# Altium schematic sheet MB786.SchDoc
size A3; Revision: C.2(PCB.SCH)
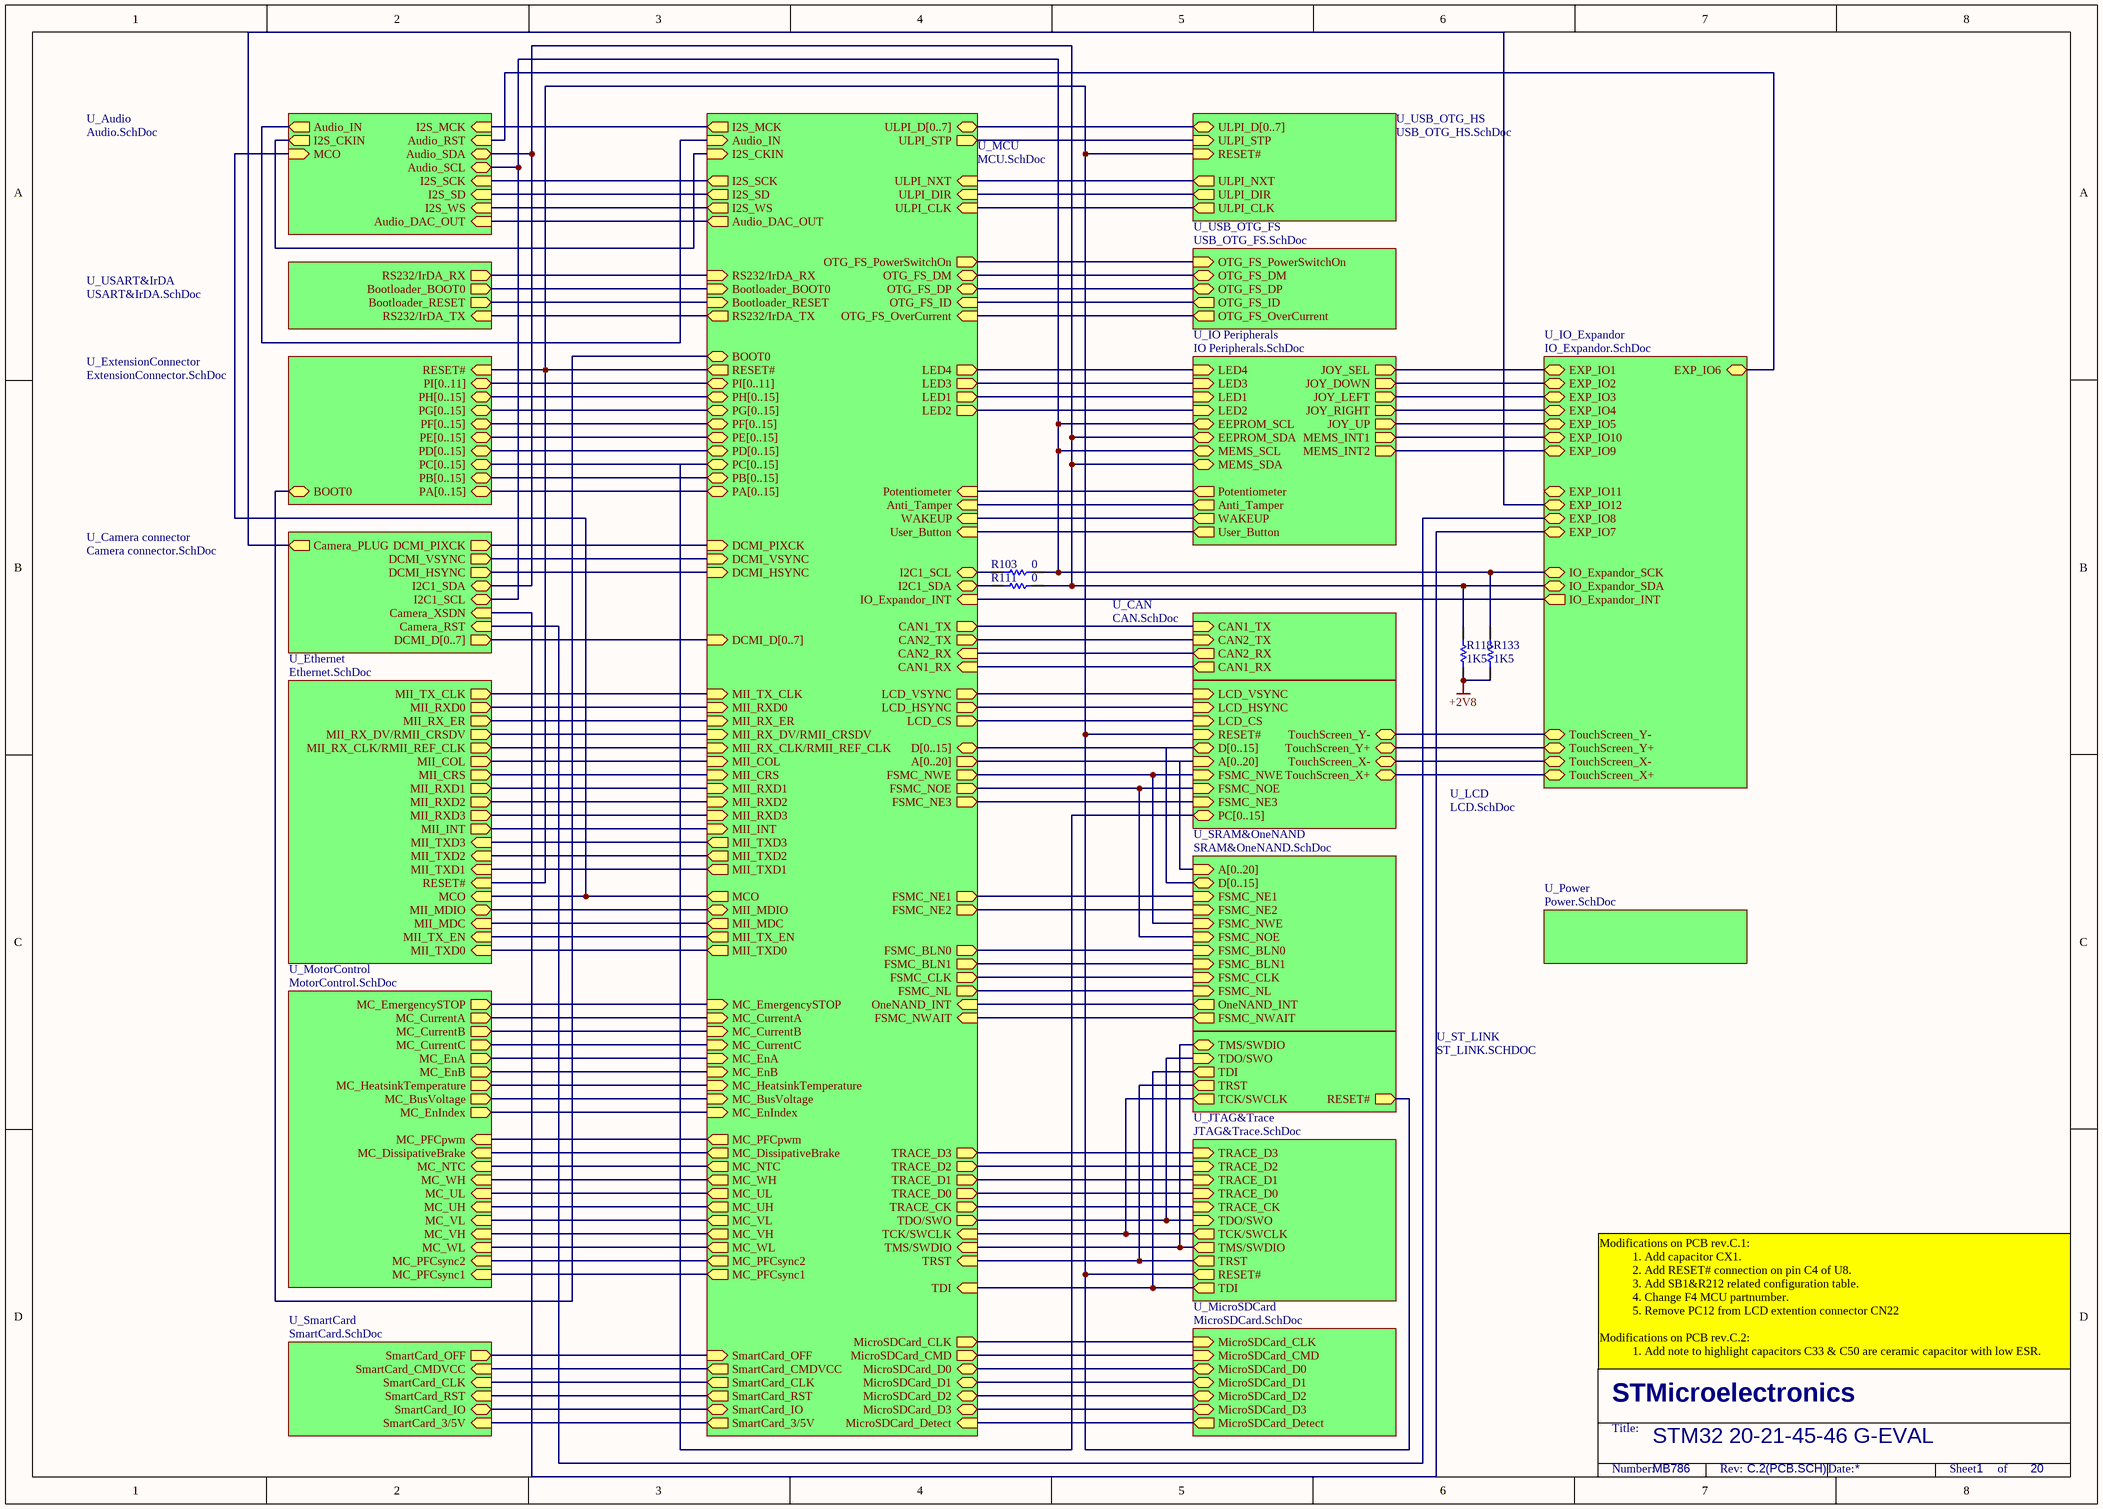
[diagram p0: MB786.SchDoc]

## Parts
R103  0  [0603R]
R111  0  [0603R]
R118  1K5  [0603R]
R133  1K5  [0603R]

## Sub-sheets
U_Audio = Audio.SchDoc: I2S_WS (in), I2S_SD (in), I2S_SCK (in), Audio_SCL (bidir), Audio_SDA (bidir), Audio_RST (in), I2S_MCK (in), Audio_DAC_OUT (in), Audio_IN (out), I2S_CKIN (out), MCO (in)
U_Camera connector = Camera connector.SchDoc: DCMI_PIXCK (out), DCMI_VSYNC (out), DCMI_D[0..7] (out), DCMI_HSYNC (out), Camera_RST (in), I2C1_SCL (bidir), I2C1_SDA (bidir), Camera_XSDN (in), Camera_PLUG (out)
U_CAN = CAN.SchDoc: CAN1_TX (in), CAN1_RX (out), CAN2_TX (in), CAN2_RX (out)
U_Ethernet = Ethernet.SchDoc: MII_TXD0 (in), MII_TX_EN (in), MII_TX_CLK (out), MII_RXD0 (out), MII_RX_ER (out), MII_RX_DV/RMII_CRSDV (out), MII_RX_CLK/RMII_REF_CLK (out), MII_COL (out), MII_CRS (out), MII_MDC (in), MII_MDIO (bidir), MCO (in), RESET# (in), MII_TXD1 (in), MII_TXD2 (in), MII_TXD3 (in), MII_RXD1 (out), MII_RXD2 (out), MII_RXD3 (out), MII_INT (out)
U_ExtensionConnector = ExtensionConnector.SchDoc: RESET# (in), PA[0..15] (bidir), PB[0..15] (bidir), PC[0..15] (bidir), PD[0..15] (bidir), PE[0..15] (bidir), PF[0..15] (bidir), PG[0..15] (bidir), PH[0..15] (bidir), PI[0..11] (bidir), BOOT0 (bidir)
U_IO Peripherals = IO Peripherals.SchDoc: LED4 (in), LED3 (in), LED1 (in), LED2 (in), Potentiometer (out), JOY_SEL (out), JOY_DOWN (out), JOY_LEFT (out), JOY_RIGHT (out), JOY_UP (out), Anti_Tamper (out), WAKEUP (out), User_Button (out), EEPROM_SCL (bidir), EEPROM_SDA (bidir), MEMS_SCL (bidir), MEMS_SDA (bidir), MEMS_INT1 (out), MEMS_INT2 (out)
U_IO_Expandor = IO_Expandor.SchDoc: IO_Expandor_SCK (bidir), IO_Expandor_SDA (bidir), IO_Expandor_INT (out), TouchScreen_X+ (bidir), TouchScreen_X- (bidir), TouchScreen_Y+ (bidir), TouchScreen_Y- (bidir), EXP_IO2 (bidir), EXP_IO3 (bidir), EXP_IO4 (bidir), EXP_IO5 (bidir), EXP_IO6 (bidir), EXP_IO7 (bidir), EXP_IO8 (bidir), EXP_IO9 (bidir), EXP_IO10 (bidir), EXP_IO11 (bidir), EXP_IO12 (bidir), EXP_IO1 (bidir)
U_JTAG&Trace = JTAG&Trace.SchDoc: TDI (out), RESET# (out), TRACE_D3 (in), TRACE_D2 (in), TRACE_D1 (in), TRACE_D0 (in), TRACE_CK (in), TRST (out), TMS/SWDIO (out), TCK/SWCLK (out), TDO/SWO (in)
U_LCD = LCD.SchDoc: TouchScreen_X+ (bidir), TouchScreen_X- (bidir), TouchScreen_Y+ (bidir), TouchScreen_Y- (bidir), RESET# (in), D[0..15] (bidir), A[0..20] (in), FSMC_NWE (in), FSMC_NOE (in), FSMC_NE3 (in), LCD_VSYNC (in), LCD_HSYNC (in), LCD_CS (in), PC[0..15] (bidir)
U_MCU = MCU.SchDoc: PA[0..15] (bidir), PB[0..15] (bidir), PC[0..15] (bidir), PD[0..15] (bidir), PE[0..15] (bidir), RESET# (out), Bootloader_BOOT0 (in), Bootloader_RESET (in), DCMI_PIXCK (in), DCMI_VSYNC (in), DCMI_D[0..7] (in), DCMI_HSYNC (in), MCO (out), ULPI_D[0..7] (bidir), ULPI_CLK (in), ULPI_DIR (in), ULPI_NXT (in), ULPI_STP (out), RS232/IrDA_TX (out), RS232/IrDA_RX (in), OTG_FS_PowerSwitchOn (out), OTG_FS_OverCurrent (in), OTG_FS_DM (bidir), OTG_FS_DP (bidir), OTG_FS_ID (in), I2S_WS (out), I2S_SD (out), I2S_SCK (out), I2S_MCK (out), Audio_DAC_OUT (out), CAN1_TX (out), CAN1_RX (in), CAN2_TX (out), CAN2_RX (in), MII_TXD0 (out), MII_TX_EN (out), MII_TX_CLK (in), MII_RXD0 (in), MII_RX_ER (in), MII_RX_DV/RMII_CRSDV (in), MII_RX_CLK/RMII_REF_CLK (in), MII_COL (in), MII_CRS (in), MII_MDC (out), MII_MDIO (bidir), MII_TXD1 (out), MII_TXD2 (out), MII_TXD3 (out), MII_RXD1 (in), MII_RXD2 (in), MII_RXD3 (in), MII_INT (in), LED4 (out), LED3 (out), LED1 (out), LED2 (out), Potentiometer (in), Anti_Tamper (in), WAKEUP (in), User_Button (in), I2C1_SCL (bidir), I2C1_SDA (bidir), IO_Expandor_INT (in), TDI (in), TRACE_D3 (out), TRACE_D2 (out), TRACE_D1 (out), TRACE_D0 (out), TRACE_CK (out), TRST (in), TMS/SWDIO (in), TCK/SWCLK (in), TDO/SWO (out), D[0..15] (bidir), A[0..20] (out), FSMC_NE3 (out), MicroSDCard_CLK (out), MicroSDCard_CMD (out), MicroSDCard_D0 (bidir), MicroSDCard_D1 (bidir), MicroSDCard_D2 (bidir), MicroSDCard_D3 (bidir), MicroSDCard_Detect (in), MC_EmergencySTOP (in), MC_CurrentA (in), MC_CurrentB (in), MC_CurrentC (in), MC_PFCsync1 (out), MC_PFCsync2 (out), MC_WL (out), MC_VH (out), MC_VL (out), MC_UH (out), MC_UL (out), MC_WH (out), MC_NTC (out), MC_DissipativeBrake (out), MC_PFCpwm (out), MC_EnA (in), MC_EnB (in), MC_HeatsinkTemperature (in), MC_BusVoltage (in), MC_EnIndex (in), SmartCard_3/5V (out), SmartCard_IO (bidir), SmartCard_RST (out), SmartCard_CLK (out), SmartCard_OFF (in), SmartCard_CMDVCC (out), FSMC_NE1 (out), FSMC_NE2 (out), FSMC_NWE (out), FSMC_NOE (out), FSMC_BLN0 (out), FSMC_BLN1 (out), FSMC_NWAIT (in), FSMC_CLK (out), FSMC_NL (out), OneNAND_INT (in), PF[0..15] (bidir), PG[0..15] (bidir), PH[0..15] (bidir), PI[0..11] (bidir), BOOT0 (bidir), Audio_IN (in), LCD_VSYNC (out), LCD_HSYNC (out), LCD_CS (out), I2S_CKIN (in)
U_MicroSDCard = MicroSDCard.SchDoc: MicroSDCard_CLK (in), MicroSDCard_CMD (in), MicroSDCard_D0 (bidir), MicroSDCard_D1 (bidir), MicroSDCard_D2 (bidir), MicroSDCard_D3 (bidir), MicroSDCard_Detect (out)
U_MotorControl = MotorControl.SchDoc: MC_EmergencySTOP (out), MC_CurrentA (out), MC_CurrentB (out), MC_CurrentC (out), MC_PFCsync1 (in), MC_PFCsync2 (in), MC_WL (in), MC_VH (in), MC_VL (in), MC_UH (in), MC_UL (in), MC_WH (in), MC_NTC (in), MC_DissipativeBrake (in), MC_PFCpwm (in), MC_EnA (out), MC_EnB (out), MC_HeatsinkTemperature (out), MC_BusVoltage (out), MC_EnIndex (out)
U_Power = Power.SchDoc: no entries
U_SmartCard = SmartCard.SchDoc: SmartCard_3/5V (in), SmartCard_IO (bidir), SmartCard_RST (in), SmartCard_CLK (in), SmartCard_OFF (out), SmartCard_CMDVCC (in)
U_SRAM&OneNAND = SRAM&OneNAND.SchDoc: A[0..20] (in), D[0..15] (bidir), FSMC_NE1 (in), FSMC_NE2 (in), FSMC_NWE (in), FSMC_NOE (in), FSMC_BLN0 (in), FSMC_BLN1 (in), FSMC_NWAIT (out), FSMC_CLK (in), FSMC_NL (in), OneNAND_INT (out)
U_ST_LINK = ST_LINK.SCHDOC: TDI (out), TRST (out), TMS/SWDIO (bidir), TCK/SWCLK (out), TDO/SWO (in), RESET# (out)
U_USART&IrDA = USART&IrDA.SchDoc: RS232/IrDA_TX (in), RS232/IrDA_RX (out), Bootloader_BOOT0 (out), Bootloader_RESET (out)
U_USB_OTG_FS = USB_OTG_FS.SchDoc: OTG_FS_PowerSwitchOn (in), OTG_FS_OverCurrent (out), OTG_FS_DM (bidir), OTG_FS_DP (bidir), OTG_FS_ID (out)
U_USB_OTG_HS = USB_OTG_HS.SchDoc: ULPI_D[0..7] (bidir), ULPI_CLK (out), ULPI_DIR (out), ULPI_NXT (out), ULPI_STP (in), RESET# (in)

## Nets
+2V8: R118.1 R133.1
NetR103_1: R103.1 R133.2 ; sheet U_Audio/Audio_SCL, sheet U_Camera connector/I2C1_SCL, sheet U_IO Peripherals/EEPROM_SCL, sheet U_IO Peripherals/MEMS_SCL, sheet U_IO_Expandor/IO_Expandor_SCK
NetR103_2: R103.2 ; sheet U_MCU/I2C1_SCL
NetR111_1: R111.1 R118.2 ; sheet U_Audio/Audio_SDA, sheet U_Camera connector/I2C1_SDA, sheet U_IO Peripherals/EEPROM_SDA, sheet U_IO Peripherals/MEMS_SDA, sheet U_IO_Expandor/IO_Expandor_SDA
NetR111_2: R111.2 ; sheet U_MCU/I2C1_SDA
(unnamed): sheet U_Audio/I2S_WS, sheet U_MCU/I2S_WS
(unnamed): sheet U_Audio/I2S_SD, sheet U_MCU/I2S_SD
(unnamed): sheet U_Audio/I2S_SCK, sheet U_MCU/I2S_SCK
(unnamed): sheet U_Audio/Audio_RST, sheet U_IO_Expandor/EXP_IO6
(unnamed): sheet U_Audio/I2S_MCK, sheet U_MCU/I2S_MCK
(unnamed): sheet U_Audio/Audio_DAC_OUT, sheet U_MCU/Audio_DAC_OUT
(unnamed): sheet U_Audio/Audio_IN, sheet U_MCU/Audio_IN
(unnamed): sheet U_Audio/I2S_CKIN, sheet U_MCU/I2S_CKIN
(unnamed): sheet U_Audio/MCO, sheet U_Ethernet/MCO, sheet U_MCU/MCO
(unnamed): sheet U_Camera connector/DCMI_PIXCK, sheet U_MCU/DCMI_PIXCK
(unnamed): sheet U_Camera connector/DCMI_VSYNC, sheet U_MCU/DCMI_VSYNC
(unnamed): sheet U_Camera connector/DCMI_HSYNC, sheet U_MCU/DCMI_HSYNC
(unnamed): sheet U_Camera connector/Camera_RST, sheet U_IO_Expandor/EXP_IO8
(unnamed): sheet U_Camera connector/Camera_XSDN, sheet U_IO_Expandor/EXP_IO7
(unnamed): sheet U_Camera connector/Camera_PLUG, sheet U_IO_Expandor/EXP_IO12
(unnamed): sheet U_CAN/CAN1_TX, sheet U_MCU/CAN1_TX
(unnamed): sheet U_CAN/CAN1_RX, sheet U_MCU/CAN1_RX
(unnamed): sheet U_CAN/CAN2_TX, sheet U_MCU/CAN2_TX
(unnamed): sheet U_CAN/CAN2_RX, sheet U_MCU/CAN2_RX
(unnamed): sheet U_Ethernet/MII_TXD0, sheet U_MCU/MII_TXD0
(unnamed): sheet U_Ethernet/MII_TX_EN, sheet U_MCU/MII_TX_EN
(unnamed): sheet U_Ethernet/MII_TX_CLK, sheet U_MCU/MII_TX_CLK
(unnamed): sheet U_Ethernet/MII_RXD0, sheet U_MCU/MII_RXD0
(unnamed): sheet U_Ethernet/MII_RX_ER, sheet U_MCU/MII_RX_ER
(unnamed): sheet U_Ethernet/MII_RX_DV/RMII_CRSDV, sheet U_MCU/MII_RX_DV/RMII_CRSDV
(unnamed): sheet U_Ethernet/MII_RX_CLK/RMII_REF_CLK, sheet U_MCU/MII_RX_CLK/RMII_REF_CLK
(unnamed): sheet U_Ethernet/MII_COL, sheet U_MCU/MII_COL
(unnamed): sheet U_Ethernet/MII_CRS, sheet U_MCU/MII_CRS
(unnamed): sheet U_Ethernet/MII_MDC, sheet U_MCU/MII_MDC
(unnamed): sheet U_Ethernet/MII_MDIO, sheet U_MCU/MII_MDIO
(unnamed): sheet U_Ethernet/RESET#, sheet U_ExtensionConnector/RESET#, sheet U_JTAG&Trace/RESET#, sheet U_LCD/RESET#, sheet U_MCU/RESET#, sheet U_USB_OTG_HS/RESET#, sheet U_ST_LINK/RESET#
(unnamed): sheet U_Ethernet/MII_TXD1, sheet U_MCU/MII_TXD1
(unnamed): sheet U_Ethernet/MII_TXD2, sheet U_MCU/MII_TXD2
(unnamed): sheet U_Ethernet/MII_TXD3, sheet U_MCU/MII_TXD3
(unnamed): sheet U_Ethernet/MII_RXD1, sheet U_MCU/MII_RXD1
(unnamed): sheet U_Ethernet/MII_RXD2, sheet U_MCU/MII_RXD2
(unnamed): sheet U_Ethernet/MII_RXD3, sheet U_MCU/MII_RXD3
(unnamed): sheet U_Ethernet/MII_INT, sheet U_MCU/MII_INT
(unnamed): sheet U_ExtensionConnector/BOOT0, sheet U_MCU/BOOT0
(unnamed): sheet U_IO Peripherals/LED4, sheet U_MCU/LED4
(unnamed): sheet U_IO Peripherals/LED3, sheet U_MCU/LED3
(unnamed): sheet U_IO Peripherals/LED1, sheet U_MCU/LED1
(unnamed): sheet U_IO Peripherals/LED2, sheet U_MCU/LED2
(unnamed): sheet U_IO Peripherals/Potentiometer, sheet U_MCU/Potentiometer
(unnamed): sheet U_IO Peripherals/JOY_SEL, sheet U_IO_Expandor/EXP_IO1
(unnamed): sheet U_IO Peripherals/JOY_DOWN, sheet U_IO_Expandor/EXP_IO2
(unnamed): sheet U_IO Peripherals/JOY_LEFT, sheet U_IO_Expandor/EXP_IO3
(unnamed): sheet U_IO Peripherals/JOY_RIGHT, sheet U_IO_Expandor/EXP_IO4
(unnamed): sheet U_IO Peripherals/JOY_UP, sheet U_IO_Expandor/EXP_IO5
(unnamed): sheet U_IO Peripherals/Anti_Tamper, sheet U_MCU/Anti_Tamper
(unnamed): sheet U_IO Peripherals/WAKEUP, sheet U_MCU/WAKEUP
(unnamed): sheet U_IO Peripherals/User_Button, sheet U_MCU/User_Button
(unnamed): sheet U_IO Peripherals/MEMS_INT1, sheet U_IO_Expandor/EXP_IO10
(unnamed): sheet U_IO Peripherals/MEMS_INT2, sheet U_IO_Expandor/EXP_IO9
(unnamed): sheet U_IO_Expandor/IO_Expandor_INT, sheet U_MCU/IO_Expandor_INT
(unnamed): sheet U_IO_Expandor/TouchScreen_X+, sheet U_LCD/TouchScreen_X+
(unnamed): sheet U_IO_Expandor/TouchScreen_X-, sheet U_LCD/TouchScreen_X-
(unnamed): sheet U_IO_Expandor/TouchScreen_Y+, sheet U_LCD/TouchScreen_Y+
(unnamed): sheet U_IO_Expandor/TouchScreen_Y-, sheet U_LCD/TouchScreen_Y-
(unnamed): sheet U_JTAG&Trace/TDI, sheet U_MCU/TDI, sheet U_ST_LINK/TDI
(unnamed): sheet U_JTAG&Trace/TRACE_D3, sheet U_MCU/TRACE_D3
(unnamed): sheet U_JTAG&Trace/TRACE_D2, sheet U_MCU/TRACE_D2
(unnamed): sheet U_JTAG&Trace/TRACE_D1, sheet U_MCU/TRACE_D1
(unnamed): sheet U_JTAG&Trace/TRACE_D0, sheet U_MCU/TRACE_D0
(unnamed): sheet U_JTAG&Trace/TRACE_CK, sheet U_MCU/TRACE_CK
(unnamed): sheet U_JTAG&Trace/TRST, sheet U_MCU/TRST, sheet U_ST_LINK/TRST
(unnamed): sheet U_JTAG&Trace/TMS/SWDIO, sheet U_MCU/TMS/SWDIO, sheet U_ST_LINK/TMS/SWDIO
(unnamed): sheet U_JTAG&Trace/TCK/SWCLK, sheet U_MCU/TCK/SWCLK, sheet U_ST_LINK/TCK/SWCLK
(unnamed): sheet U_JTAG&Trace/TDO/SWO, sheet U_MCU/TDO/SWO, sheet U_ST_LINK/TDO/SWO
(unnamed): sheet U_LCD/FSMC_NWE, sheet U_MCU/FSMC_NWE, sheet U_SRAM&OneNAND/FSMC_NWE
(unnamed): sheet U_LCD/FSMC_NOE, sheet U_MCU/FSMC_NOE, sheet U_SRAM&OneNAND/FSMC_NOE
(unnamed): sheet U_LCD/FSMC_NE3, sheet U_MCU/FSMC_NE3
(unnamed): sheet U_LCD/LCD_VSYNC, sheet U_MCU/LCD_VSYNC
(unnamed): sheet U_LCD/LCD_HSYNC, sheet U_MCU/LCD_HSYNC
(unnamed): sheet U_LCD/LCD_CS, sheet U_MCU/LCD_CS
(unnamed): sheet U_MCU/Bootloader_BOOT0, sheet U_USART&IrDA/Bootloader_BOOT0
(unnamed): sheet U_MCU/Bootloader_RESET, sheet U_USART&IrDA/Bootloader_RESET
(unnamed): sheet U_MCU/ULPI_CLK, sheet U_USB_OTG_HS/ULPI_CLK
(unnamed): sheet U_MCU/ULPI_DIR, sheet U_USB_OTG_HS/ULPI_DIR
(unnamed): sheet U_MCU/ULPI_NXT, sheet U_USB_OTG_HS/ULPI_NXT
(unnamed): sheet U_MCU/ULPI_STP, sheet U_USB_OTG_HS/ULPI_STP
(unnamed): sheet U_MCU/RS232/IrDA_TX, sheet U_USART&IrDA/RS232/IrDA_TX
(unnamed): sheet U_MCU/RS232/IrDA_RX, sheet U_USART&IrDA/RS232/IrDA_RX
(unnamed): sheet U_MCU/OTG_FS_PowerSwitchOn, sheet U_USB_OTG_FS/OTG_FS_PowerSwitchOn
(unnamed): sheet U_MCU/OTG_FS_OverCurrent, sheet U_USB_OTG_FS/OTG_FS_OverCurrent
(unnamed): sheet U_MCU/OTG_FS_DM, sheet U_USB_OTG_FS/OTG_FS_DM
(unnamed): sheet U_MCU/OTG_FS_DP, sheet U_USB_OTG_FS/OTG_FS_DP
(unnamed): sheet U_MCU/OTG_FS_ID, sheet U_USB_OTG_FS/OTG_FS_ID
(unnamed): sheet U_MCU/MicroSDCard_CLK, sheet U_MicroSDCard/MicroSDCard_CLK
(unnamed): sheet U_MCU/MicroSDCard_CMD, sheet U_MicroSDCard/MicroSDCard_CMD
(unnamed): sheet U_MCU/MicroSDCard_D0, sheet U_MicroSDCard/MicroSDCard_D0
(unnamed): sheet U_MCU/MicroSDCard_D1, sheet U_MicroSDCard/MicroSDCard_D1
(unnamed): sheet U_MCU/MicroSDCard_D2, sheet U_MicroSDCard/MicroSDCard_D2
(unnamed): sheet U_MCU/MicroSDCard_D3, sheet U_MicroSDCard/MicroSDCard_D3
(unnamed): sheet U_MCU/MicroSDCard_Detect, sheet U_MicroSDCard/MicroSDCard_Detect
(unnamed): sheet U_MCU/MC_EmergencySTOP, sheet U_MotorControl/MC_EmergencySTOP
(unnamed): sheet U_MCU/MC_CurrentA, sheet U_MotorControl/MC_CurrentA
(unnamed): sheet U_MCU/MC_CurrentB, sheet U_MotorControl/MC_CurrentB
(unnamed): sheet U_MCU/MC_CurrentC, sheet U_MotorControl/MC_CurrentC
(unnamed): sheet U_MCU/MC_PFCsync1, sheet U_MotorControl/MC_PFCsync1
(unnamed): sheet U_MCU/MC_PFCsync2, sheet U_MotorControl/MC_PFCsync2
(unnamed): sheet U_MCU/MC_WL, sheet U_MotorControl/MC_WL
(unnamed): sheet U_MCU/MC_VH, sheet U_MotorControl/MC_VH
(unnamed): sheet U_MCU/MC_VL, sheet U_MotorControl/MC_VL
(unnamed): sheet U_MCU/MC_UH, sheet U_MotorControl/MC_UH
(unnamed): sheet U_MCU/MC_UL, sheet U_MotorControl/MC_UL
(unnamed): sheet U_MCU/MC_WH, sheet U_MotorControl/MC_WH
(unnamed): sheet U_MCU/MC_NTC, sheet U_MotorControl/MC_NTC
(unnamed): sheet U_MCU/MC_DissipativeBrake, sheet U_MotorControl/MC_DissipativeBrake
(unnamed): sheet U_MCU/MC_PFCpwm, sheet U_MotorControl/MC_PFCpwm
(unnamed): sheet U_MCU/MC_EnA, sheet U_MotorControl/MC_EnA
(unnamed): sheet U_MCU/MC_EnB, sheet U_MotorControl/MC_EnB
(unnamed): sheet U_MCU/MC_HeatsinkTemperature, sheet U_MotorControl/MC_HeatsinkTemperature
(unnamed): sheet U_MCU/MC_BusVoltage, sheet U_MotorControl/MC_BusVoltage
(unnamed): sheet U_MCU/MC_EnIndex, sheet U_MotorControl/MC_EnIndex
(unnamed): sheet U_MCU/SmartCard_3/5V, sheet U_SmartCard/SmartCard_3/5V
(unnamed): sheet U_MCU/SmartCard_IO, sheet U_SmartCard/SmartCard_IO
(unnamed): sheet U_MCU/SmartCard_RST, sheet U_SmartCard/SmartCard_RST
(unnamed): sheet U_MCU/SmartCard_CLK, sheet U_SmartCard/SmartCard_CLK
(unnamed): sheet U_MCU/SmartCard_OFF, sheet U_SmartCard/SmartCard_OFF
(unnamed): sheet U_MCU/SmartCard_CMDVCC, sheet U_SmartCard/SmartCard_CMDVCC
(unnamed): sheet U_MCU/FSMC_NE1, sheet U_SRAM&OneNAND/FSMC_NE1
(unnamed): sheet U_MCU/FSMC_NE2, sheet U_SRAM&OneNAND/FSMC_NE2
(unnamed): sheet U_MCU/FSMC_BLN0, sheet U_SRAM&OneNAND/FSMC_BLN0
(unnamed): sheet U_MCU/FSMC_BLN1, sheet U_SRAM&OneNAND/FSMC_BLN1
(unnamed): sheet U_MCU/FSMC_NWAIT, sheet U_SRAM&OneNAND/FSMC_NWAIT
(unnamed): sheet U_MCU/FSMC_CLK, sheet U_SRAM&OneNAND/FSMC_CLK
(unnamed): sheet U_MCU/FSMC_NL, sheet U_SRAM&OneNAND/FSMC_NL
(unnamed): sheet U_MCU/OneNAND_INT, sheet U_SRAM&OneNAND/OneNAND_INT

## Buses and harness runs
bus sheet U_Camera connector/DCMI_D[0..7] = sheet U_MCU/DCMI_D[0..7]
bus sheet U_ExtensionConnector/PA[0..15] = sheet U_MCU/PA[0..15]
bus sheet U_ExtensionConnector/PB[0..15] = sheet U_MCU/PB[0..15]
bus sheet U_ExtensionConnector/PC[0..15] = sheet U_LCD/PC[0..15] = sheet U_MCU/PC[0..15]
bus sheet U_ExtensionConnector/PD[0..15] = sheet U_MCU/PD[0..15]
bus sheet U_ExtensionConnector/PE[0..15] = sheet U_MCU/PE[0..15]
bus sheet U_ExtensionConnector/PF[0..15] = sheet U_MCU/PF[0..15]
bus sheet U_ExtensionConnector/PG[0..15] = sheet U_MCU/PG[0..15]
bus sheet U_ExtensionConnector/PH[0..15] = sheet U_MCU/PH[0..15]
bus sheet U_ExtensionConnector/PI[0..11] = sheet U_MCU/PI[0..11]
bus sheet U_LCD/A[0..20] = sheet U_MCU/A[0..20] = sheet U_SRAM&OneNAND/A[0..20]
bus sheet U_LCD/D[0..15] = sheet U_MCU/D[0..15] = sheet U_SRAM&OneNAND/D[0..15]
bus sheet U_MCU/ULPI_D[0..7] = sheet U_USB_OTG_HS/ULPI_D[0..7]

## Notes on the sheet
- Modifications on PCB rev.C.1:
  1. Add capacitor CX1.
  2. Add RESET# connection on pin C4 of U8.
  3. Add SB1&R212 related configuration table.
  4. Change F4 MCU partnumber.
  5. Remove PC12 from LCD extention connector CN22
  Modifications on PCB rev.C.2:
  1. Add note to highlight capacitors C33 & C50 are ceramic capacitor with low ESR.
- STM32 20-21-45-46 G-EVAL
- MB786
- 1
- 20
- STMicroelectronics
- Title:
- Number:
- Rev:
- Date:
- Sheet       of

## Library data of the parts
R103 R111 R118 R133 = Res1: Resistor; Value: 1K; Published: 8-Jun-2000; Revision: July-2002: Re-released for DXP Platform.; Publisher: Altium Limited